# Altium schematic sheet R2Cloud.SchDoc
size A4
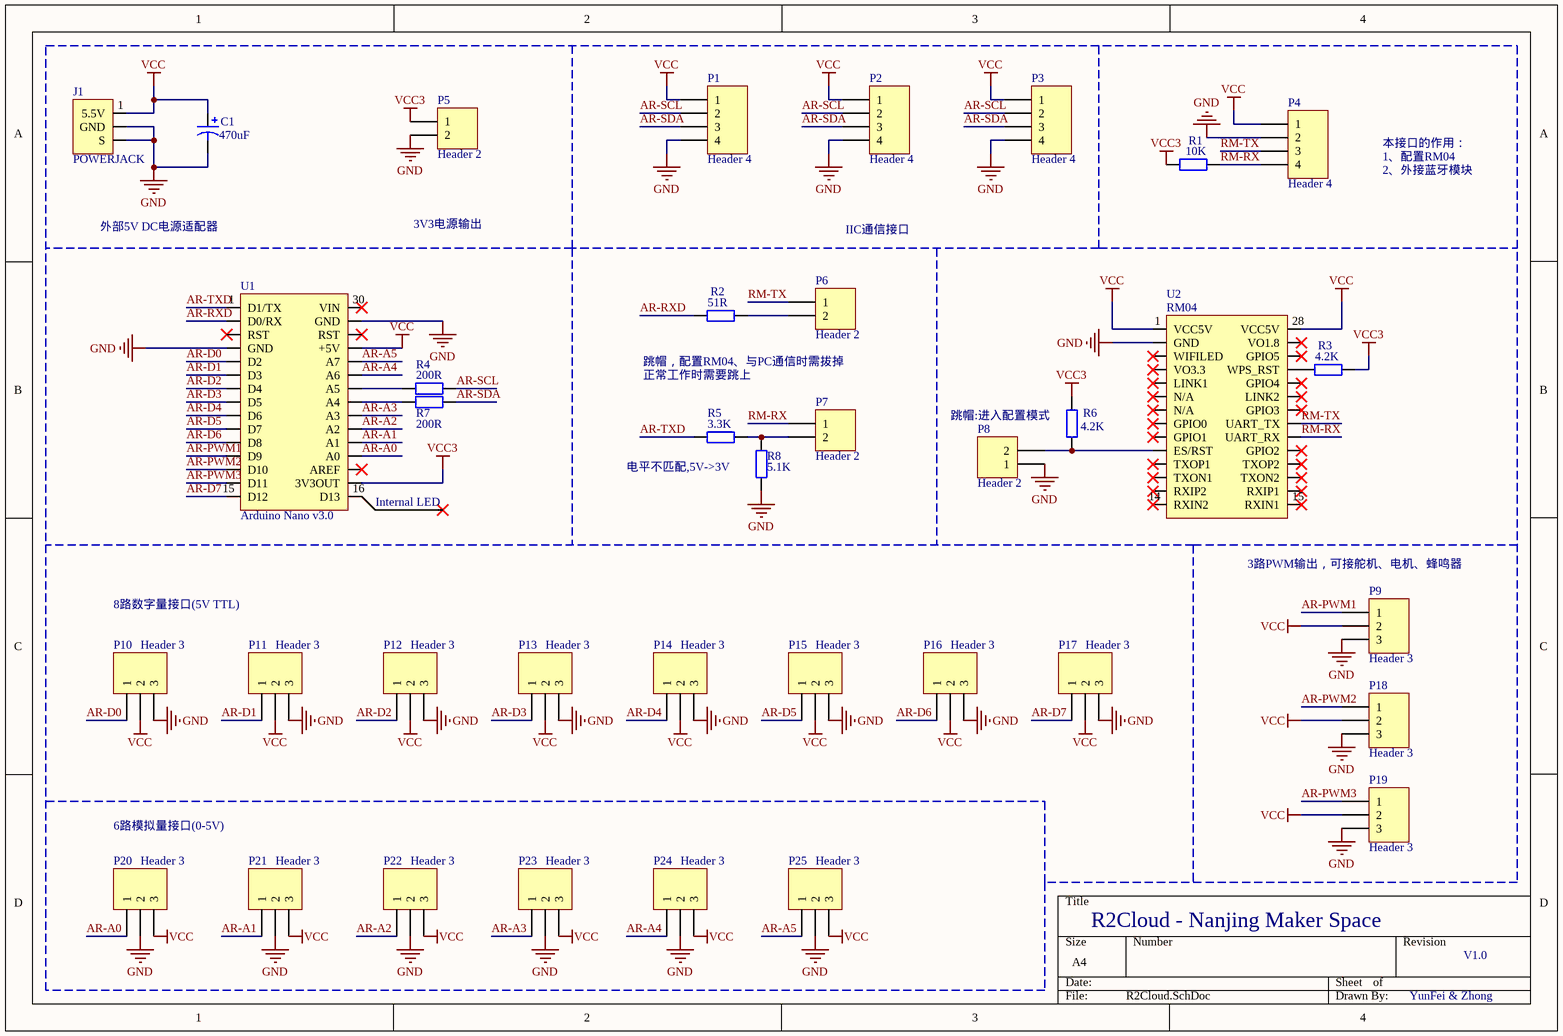
[diagram p0: R2Cloud.SchDoc]

## Parts
C1  value 470uF  [C3.81/7.62]  (hidden comment: Cap Pol3)
J1  POWERJACK  [POWERJACK]
P1  Header 4  [CON4-IIC]
P2  Header 4  [CON4-IIC]
P3  Header 4  [CON4-IIC]
P4  Header 4  [CON4-EX]
P5  Header 2  [CON2-V3.3]
P6  Header 2  [CON2-JUMPER]
P7  Header 2  [CON2-JUMPER]
P8  Header 2  [CON2-JUMPER]
P9  Header 3  [CON3-PWM]
P10  Header 3  [CON3-D]
P11  Header 3  [CON3-D]
P12  Header 3  [CON3-D]
P13  Header 3  [CON3-D]
P14  Header 3  [CON3-D]
P15  Header 3  [CON3-D]
P16  Header 3  [CON3-D]
P17  Header 3  [CON3-D]
P18  Header 3  [CON3-PWM]
P19  Header 3  [CON3-PWM]
P20  Header 3  [CON3-A]
P21  Header 3  [CON3-A]
P22  Header 3  [CON3-A]
P23  Header 3  [CON3-A]
P24  Header 3  [CON3-A]
P25  Header 3  [CON3-A]
R1  value 10K  [0603]  (hidden comment: Res2)
R2  value 51R  [0603]  (hidden comment: Res2)
R3  value 4.2K  [0603]  (hidden comment: Res2)
R4  value 200R  [0603]  (hidden comment: Res2)
R5  value 3.3K  [0603]  (hidden comment: Res2)
R6  value 4.2K  [0603]  (hidden comment: Res2)
R7  value 200R  [0603]  (hidden comment: Res2)
R8  value 5.1K  [0603]  (hidden comment: Res2)
U1  Arduino Nano v3.0  [Arduino Nano v3.0]
U2  RM04  [RM-04]

## Nets
GND: C1.2 J1.2(GND) J1.3(S) P1.4 P2.4 P3.4 P4.2 P5.2 P8.1 P9.3 P10.3 P11.3 P12.3 P13.3 P14.3 P15.3 P16.3 P17.3 P18.3 P19.3 P20.2 P21.2 P22.2 P23.2 P24.2 P25.2 R8.2 U1.4(GND) U1.29(GND) U2.2(GND)
VCC: C1.1 J1.1(5.5V) P1.1 P2.1 P3.1 P4.1 P9.2 P10.2 P11.2 P12.2 P13.2 P14.2 P15.2 P16.2 P17.2 P18.2 P19.2 P20.3 P21.3 P22.3 P23.3 P24.3 P25.3 U1.27(+5V) U2.1(VCC5V) U2.28(VCC5V)
VCC3: P5.1 R1.2 R3.1 R6.2 U1.17(3V3OUT)
AR-A0: P20.1 U1.19(A0)
AR-A1: P21.1 U1.20(A1)
AR-A2: P22.1 U1.21(A2)
AR-A3: P23.1 U1.22(A3)
AR-A4: P24.1 U1.25(A6)
AR-A5: P25.1 U1.26(A7)
AR-D0: P10.1 U1.5(D2)
AR-D1: P11.1 U1.6(D3)
AR-D2: P12.1 U1.7(D4)
AR-D3: P13.1 U1.8(D5)
AR-D4: P14.1 U1.9(D6)
AR-D5: P15.1 U1.10(D7)
AR-D6: P16.1 U1.11(D8)
AR-D7: P17.1 U1.15(D12)
AR-PWM1: P9.1 U1.12(D9)
AR-PWM2: P18.1 U1.13(D10)
AR-PWM3: P19.1 U1.14(D11)
AR-RXD: R2.2 U1.2(D0/RX)
AR-SCL: P1.2 P2.2 P3.2 R4.1
AR-SDA: P1.3 P2.3 P3.3 R7.1
AR-TXD: R5.2 U1.1(D1/TX)
RM-RX: P4.4 P7.1 R1.1 U2.20(UART_RX)
RM-TX: P4.3 P6.1 U2.21(UART_TX)
NetP6_2: P6.2 R2.1
NetP7_2: P7.2 R5.1 R8.1
NetP8_2: P8.2 R6.1 U2.10(ES/RST)
NetR3_2: R3.2 U2.25(WPS_RST)
NetR4_2: R4.2 U1.24(A5)
NetR7_2: R7.2 U1.23(A4)

Not connected (* = marked no-connect by the designer): U1 3(RST)* 16(D13) 18(AREF)* 28(RST)* 30(VIN)*; U2 3(WIFILED)* 4(VO3.3)* 5(LINK1)* 6(N/A)* 7(N/A)* 8(GPIO0)* 9(GPIO1)* 11(TXOP1)* 12(TXON1)* 13(RXIP2)* 14(RXIN2)* 15(RXIN1)* 16(RXIP1)* 17(TXON2)* 18(TXOP2)* 19(GPIO2)* 22(GPIO3)* 23(LINK2)* 24(GPIO4)* 26(GPIO5)* 27(VO1.8)*

## Notes on the sheet
- 本接口的作用：
- 1、配置RM04
- 2、外接蓝牙模块
- 外部5V DC电源适配器
- 3V3电源输出
- IIC通信接口
- (near R2) 跳帽，配置RM04、与PC通信时需拔掉
- 正常工作时需要跳上
- (near P8) 跳帽:进入配置模式
- (near U1) Internal LED
- (near R5) 电平不匹配,5V->3V
- 3路PWM输出，可接舵机、电机、蜂鸣器
- 8路数字量接口(5V TTL)
- 6路模拟量接口(0-5V)
- R2Cloud - Nanjing Maker Space
- V1.0
- YunFei & Zhong

## Library data of the parts
C1 = Cap Pol3: Polarized Capacitor (Surface Mount); Published: 8-Jun-2000; LatestRevisionDate: 17-Jul-2002; LatestRevisionNote: Re-released for DXP Platform.; PackageReference: C0805; Publisher: Altium Limited
P1-P4 = Header 4: Header, 4-Pin; LatestRevisionDate: 17-Jul-2002; LatestRevisionNote: Re-released for DXP Platform.; Publisher: Altium Limited
P5-P8 = Header 2: Header, 2-Pin; LatestRevisionDate: 17-Jul-2002; LatestRevisionNote: Re-released for DXP Platform.; Publisher: Altium Limited
P9-P25 = Header 3: Header, 3-Pin; LatestRevisionDate: 17-Jul-2002; LatestRevisionNote: Re-released for DXP Platform.; Publisher: Altium Limited
R1-R8 = Res2: Resistor; Published: 8-Jun-2000; LatestRevisionDate: 17-Jul-2002; LatestRevisionNote: Re-released for DXP Platform.; PackageReference: AXIAL-0.4; Publisher: Altium Limited